# EAGLE design Adafruit SIM808 Shield (EAGLE 6.6.0)
COMPANY: ADAFRUIT INDUSTRIES; DRAWN: KTOWN; REV: C
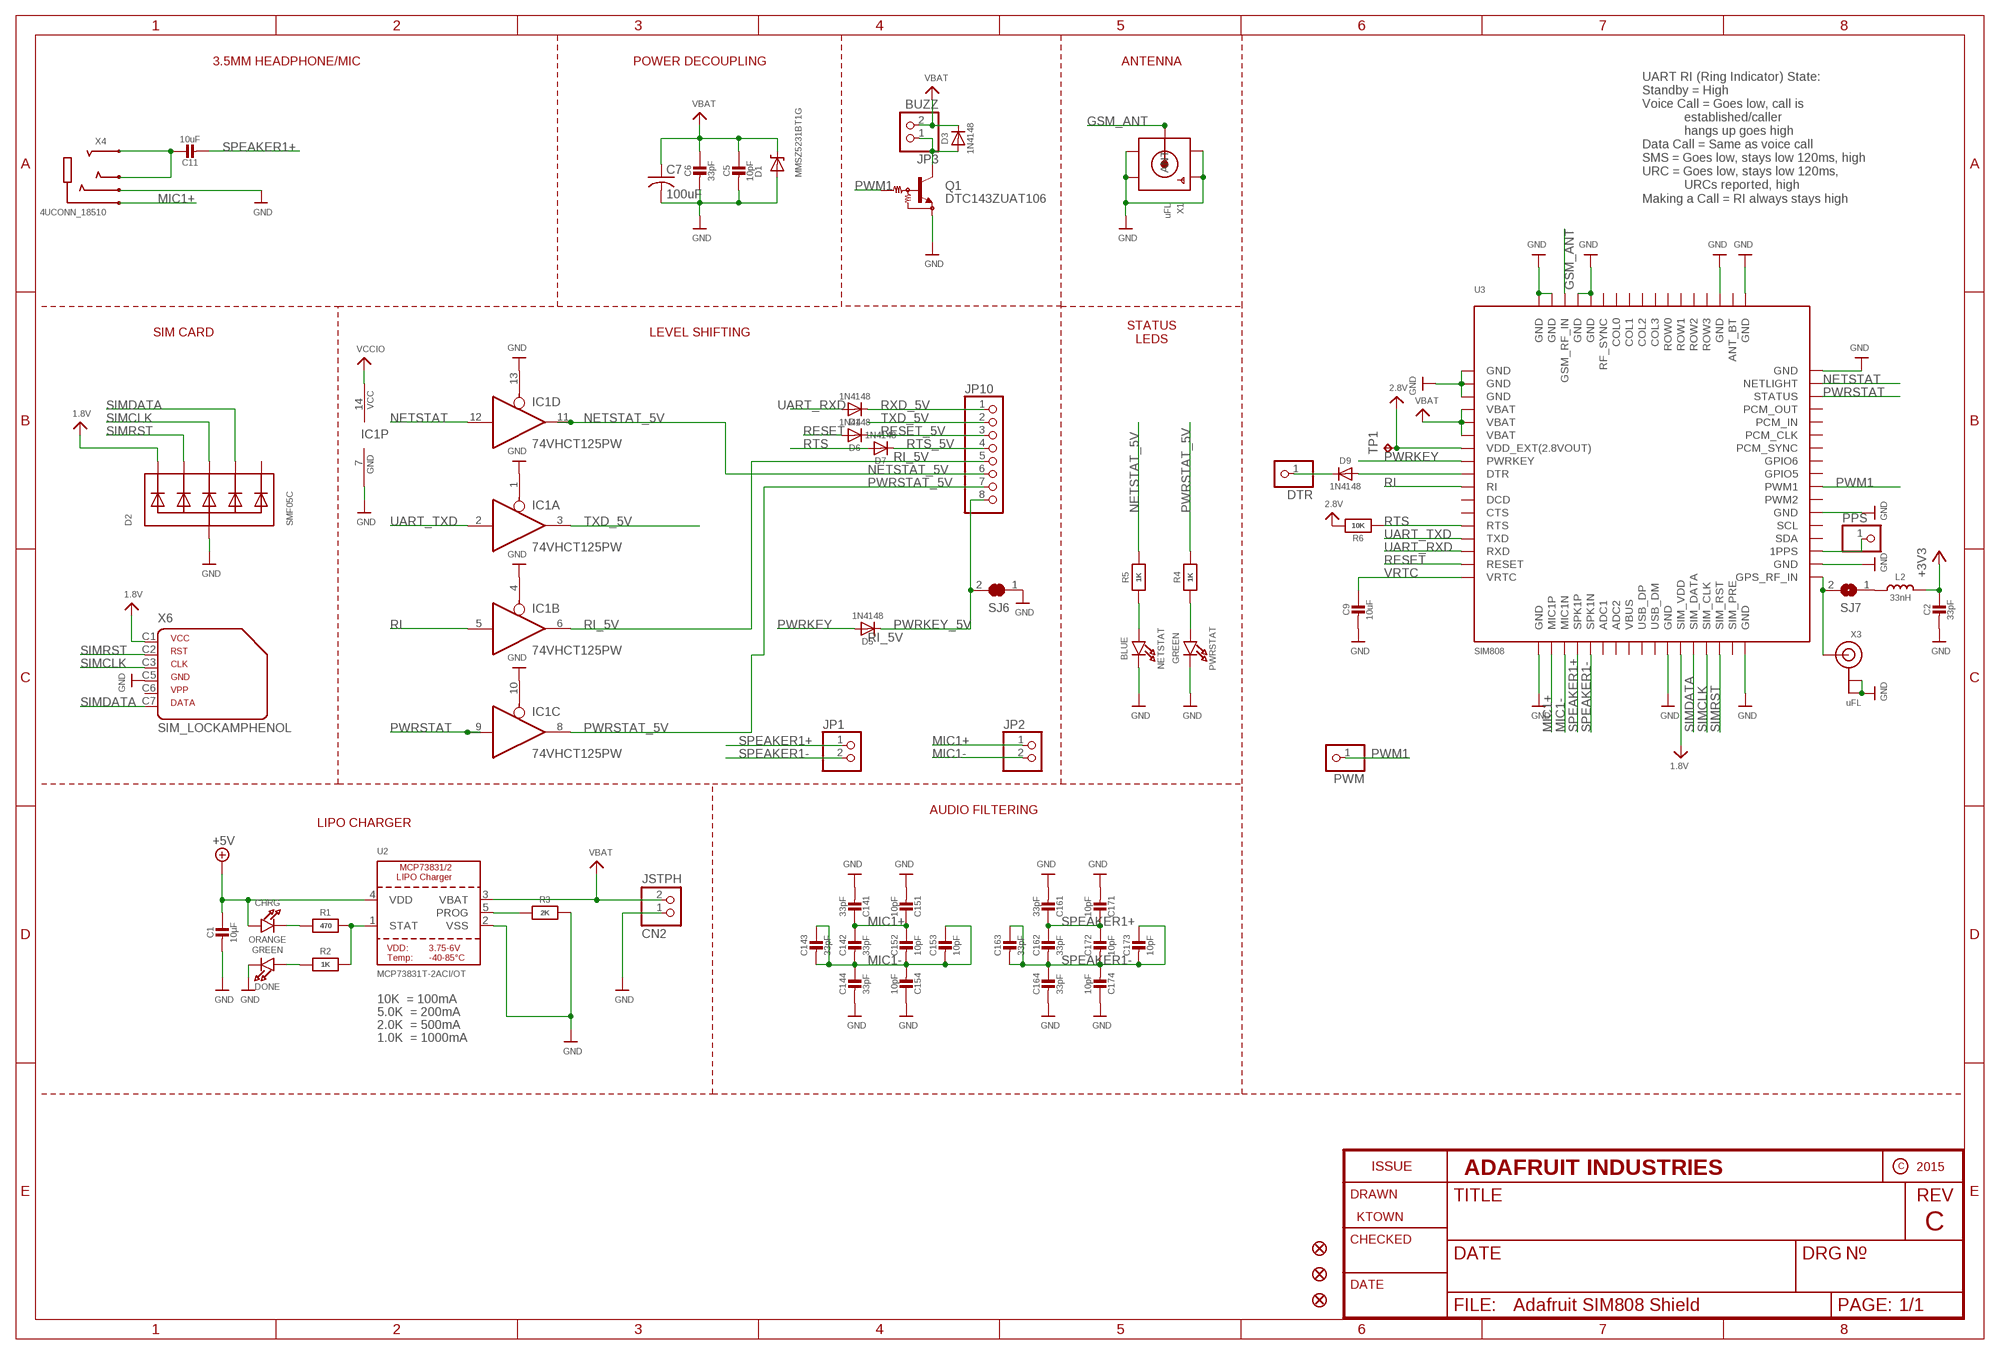
[diagram p0: schematic, sheet 1, part 1 of 2]
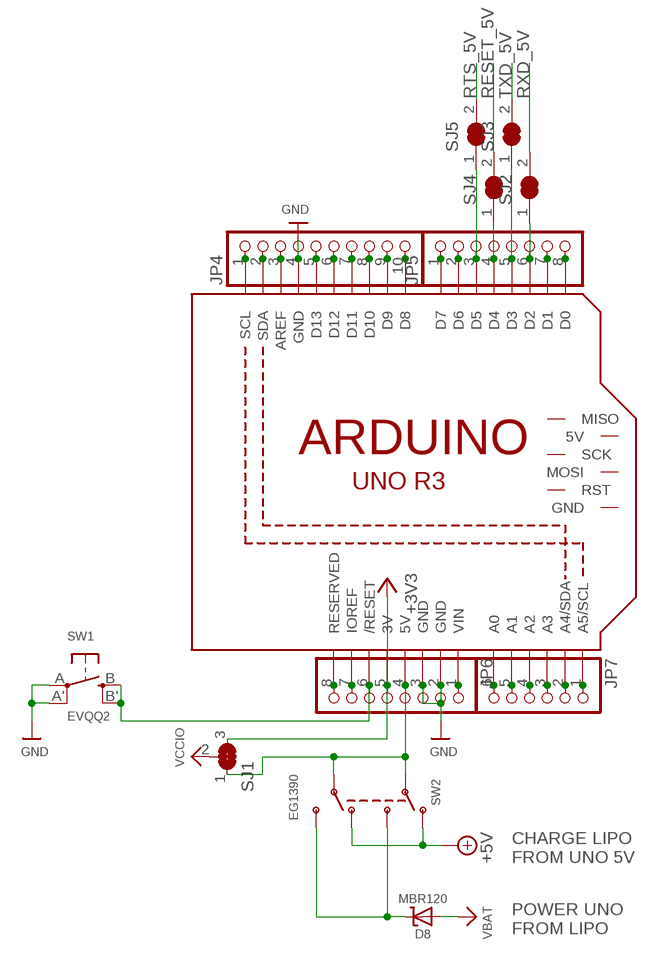
[diagram p1: schematic, sheet 1, part 2 of 2]

## Parts
C1  10µF  CAP_CERAMIC0805-NOOUTLINE  [0805-NO]
C2  33pF  CAP_CERAMIC0805-NOOUTLINE  [0805-NO]
C5  10pF  CAP_CERAMIC0805-NOOUTLINE  [0805-NO]
C6  33pF  CAP_CERAMIC0805-NOOUTLINE  [0805-NO]
C7  100uF  C-USC1210  [C1210]
C9  10uF  CAP_CERAMIC0805-NOOUTLINE  [0805-NO]
C11  10uF  CAP_CERAMIC0805-NOOUTLINE  [0805-NO]
C14  33pF  CAP_4PACK1206  [RESPACK_4X0603]
C15  10pF  CAP_4PACK1206  [RESPACK_4X0603]
C16  33pF  CAP_4PACK1206  [RESPACK_4X0603]
C17  10pF  CAP_4PACK1206  [RESPACK_4X0603]
CHRG  ORANGE  LED0805_NOOUTLINE  [CHIPLED_0805_NOOUTLINE]
CN2  JSTPH  JST_2PIN  [JSTPH2]
D1  MMSZ5231BT1G  DIODE-ZENERSOD123  [SOD-123]
D2  SMF05C  TVSARRAY_5LANE  [SOT363]
D3  1N4148  DIODESOD-323  [SOD-323]
D4  1N4148  DIODESOD-323  [SOD-323]
D5  1N4148  DIODESOD-323  [SOD-323]
D6  1N4148  DIODESOD-323  [SOD-323]
D7  1N4148  DIODESOD-323  [SOD-323]
D8  MBR120  DIODE-SCHOTTKYSOD-123  [SOD-123]
D9  1N4148  DIODESOD-323  [SOD-323]
DONE  GREEN  LED0805_NOOUTLINE  [CHIPLED_0805_NOOUTLINE]
DTR  PINHD-1X1CB  [1X01-CLEANBIG]
FID1  FIDUCIAL""  [FIDUCIAL_1MM]
FID2  FIDUCIAL""  [FIDUCIAL_1MM]
FID3  FIDUCIAL""  [FIDUCIAL_1MM]
IC1  74VHCT125PW  74ABT125PW  [TSSOP14]
JP1  HEADER-1X2ROUND  [1X02_ROUND]
JP2  HEADER-1X2ROUND  [1X02_ROUND]
JP3  BUZZ  HEADER-1X2ROUND  [1X02_ROUND]
JP4  HEADER-1X1070MIL  [1X10_ROUND70]
JP5  HEADER-1X876MIL  [1X08_ROUND_76]
JP6  HEADER-1X876MIL  [1X08_ROUND_76]
JP7  HEADER-1X676MIL  [1X06_ROUND_76]
JP10  HEADER-1X870MIL  [1X08_ROUND_70]
L2  33nH  INDUCTOR_0805MP  [_0805MP]
M1  ARDUINO_R3_ICSP_NODIM  [ARDUINOR3_ICSP_NODIM]
NETSTAT  BLUE  LED0805_NOOUTLINE  [CHIPLED_0805_NOOUTLINE]
PPS  PINHD-1X1CB  [1X01-CLEANBIG]
PWM  PINHD-1X1CB  [1X01-CLEANBIG]
PWRSTAT  GREEN  LED0805_NOOUTLINE  [CHIPLED_0805_NOOUTLINE]
Q1  DTC143ZUAT106  MUN2211T1-NPN_DRIVER-SC59-BEC  [SC59-BEC]
R1  470  RESISTOR0805_NOOUTLINE  [0805-NO]
R2  1K  RESISTOR0805_NOOUTLINE  [0805-NO]
R3  2K  RESISTOR0805_NOOUTLINE  [0805-NO]
R4  1K  RESISTOR0805_NOOUTLINE  [0805-NO]
R5  1K  RESISTOR0805_NOOUTLINE  [0805-NO]
R6  10K  RESISTOR0805_NOOUTLINE  [0805-NO]
SJ1  SOLDERJUMPER_2WAY  [SOLDERJUMPER_2WAY_OPEN_NOPASTE]
SJ2  SOLDERJUMPER_CLOSED  [SOLDERJUMPER_CLOSEDWIRE]
SJ3  SOLDERJUMPER_CLOSED  [SOLDERJUMPER_CLOSEDWIRE]
SJ4  SOLDERJUMPER_CLOSED  [SOLDERJUMPER_CLOSEDWIRE]
SJ5  SOLDERJUMPER_CLOSED  [SOLDERJUMPER_CLOSEDWIRE]
SJ6  SOLDERJUMPER_CLOSED  [SOLDERJUMPER_CLOSEDWIRE]
SJ7  SOLDERJUMPER  [SOLDERJUMPER_ARROW_NOPASTE]
SW1  EVQQ2  SWITCH_TACT_SMT  [EVQ-Q2]
SW2  EG1390  SWITCH_DPDTEG1390  [EG1390]
TP1  TPTP11R  [TP11R]
U2  MCP73831T-2ACI/OT  MCP73831/2  [SOT23-5]
U3  SIM808  GSM_SIM808_LITERAL  [SIM900_SMT]
X1  uFL  SMACONNECTOR_EDGE_UFL  [SMA_EDGELAUNCH_UFL]
X3  uFL  ANTENNA_U.FL  [U.FL]
X4  4UCONN_18510  AUDIO_3.5MMJACK_4POL  [4UCONN_18510]
X6  SIM_LOCKAMPHENOL  [C707_10M006_512_2]

## Nets
1.8V: D2.1(C1) U3.P$29(SIM_VDD) X6.C1
2.8V: R6.2 TP1.TP U3.P$7(VDD_EXT(2.8VOUT))
5V: JP6.4 M1.5V SJ1.1 SW2.P1 SW2.P2
+3V3: C2.1 JP6.5 L2.2 M1.3V SJ1.3
+5V: C1.1 CHRG.A SW2.O1 SW2.O2 U2.4(VDD)
A0: JP7.6 M1.A0
A1: JP7.5 M1.A1
A2: JP7.4 M1.A2
A3: JP7.3 M1.A3
A4: JP7.2 M1.A4(A4/SDA)
A5: JP7.1 M1.A5(A5/SCL)
AREF: JP4.3 M1.AREF
BUZZ-: D3.A JP3.1 Q1.C
D0: JP5.8 M1.D0
D1: JP5.7 M1.D1
D2: JP5.6 M1.D2 SJ2.1
D3: JP5.5 M1.D3 SJ3.1
D4: JP5.4 M1.D4 SJ4.1
D5: JP5.3 M1.D5 SJ5.1
D6: JP5.2 M1.D6
D7: JP5.1 M1.D7
D8: JP4.10 M1.D8
D9: JP4.9 M1.D9
D10: JP4.8 M1.D10
D11: JP4.7 M1.D11
D12: JP4.6 M1.D12
D13: JP4.5 M1.D13
DTR_5V: D9.C DTR.1
GND: C1.2 C2.2 C5.2 C6.2 C7.2 C9.2 C14.5 C14.8 C15.4 C15.8 C16.5 C16.8 C17.4 C17.8 CN2.1 D1.A D2.2(A) DONE.C IC1.1(A:OE) IC1.4(B:OE) IC1.7(P:GND) IC1.10(C:OE) IC1.13(D:OE) JP4.4 JP6.2 JP6.3 M1.GND M1.GND@1(GND) M1.GND@3(GND) NETSTAT.C PWRSTAT.C Q1.E R3.2 SJ6.1 SW1.A'(P1) SW1.A(P) U2.2(VSS) U3.P$1(GND) U3.P$2(GND) U3.P$3(GND) U3.P$18(GND) U3.P$28(GND) U3.P$34(GND) U3.P$36(GND) U3.P$40(GND) U3.P$51(GND) U3.P$52(GND) U3.P$54(GND) U3.P$64(GND) U3.P$65(GND) U3.P$67(GND) U3.P$68(GND) X1.GND@1(GND1) X1.GND@2(GND2) X1.GND@3(GND3) X1.GND@4(GND4) X3.1(GND) X3.2(GND) X4.4-INNER_SLEEVE(RING1) X6.C5
GPS_PPS: PPS.1 U3.P$37(1PPS)
GSM_ANT: U3.P$66(GSM_RF_IN) X1.P(ANT)
HP+: C11.1 X4.2-TIP(RING3) X4.3-OUTER_SLEEVE(RING2)
IOREF: JP6.7 M1.IOREF
MIC1+: C14.1 C14.2 C15.1 C15.2 JP2.1 U3.P$19(MIC1P) X4.1-GND(TIP)
MIC1-: C14.3 C14.4 C14.6 C14.7 C15.3 C15.5 C15.6 C15.7 JP2.2 U3.P$20(MIC1N)
N$1: CHRG.C R1.1
N$2: R1.2 R2.2 U2.1(STAT)
N$3: SJ7.2 U3.P$35(GPS_RF_IN) X3.3(SIGNAL)
N$4: PWRSTAT.A R4.1
N$5: R3.1 U2.5(PROG)
N$6: DONE.A R2.1
N$9: NETSTAT.A R5.1
N$10: D8.C SW2.S1 SW2.S2
N$31: L2.1 SJ7.1
N$42: D9.A U3.P$9(DTR)
NC: JP6.8 M1.RESERVED
NETSTAT: IC1.12(D:I) U3.P$50(NETLIGHT)
NETSTAT_5V: IC1.11(D:O) JP10.6 R5.2
PWM1: PWM.1 Q1.B U3.P$42(PWM1)
PWRKEY: D5.A U3.P$8(PWRKEY)
PWRKEY_5V: D5.C JP10.8 SJ6.2
PWRSTAT: IC1.9(C:I) U3.P$49(STATUS)
PWRSTAT_5V: IC1.8(C:O) JP10.7 R4.2
RESET: D6.A U3.P$16(RESET)
RESET_5V: D6.C JP10.3 SJ4.2
RI: IC1.5(B:I) U3.P$10(RI)
RI_5V: IC1.6(B:O) JP10.5
RST: JP6.6 M1.RESET(/RESET) SW1.B'(S1) SW1.B(S)
RTS: D7.A R6.1 U3.P$13(RTS)
RTS_5V: D7.C JP10.4 SJ5.2
RXD_5V: D4.C JP10.1 SJ2.2
SCL: JP4.1 M1.SCL
SDA: JP4.2 M1.SDA
SIMCLK: D2.4(C3) U3.P$31(SIM_CLK) X6.C3
SIMDATA: D2.5(C4) U3.P$30(SIM_DATA) X6.C7
SIMRST: D2.3(C2) U3.P$32(SIM_RST) X6.C2
SPEAKER1+: C11.2 C16.1 C16.2 C17.1 C17.2 JP1.1 U3.P$21(SPK1P)
SPEAKER1-: C16.3 C16.4 C16.6 C16.7 C17.3 C17.5 C17.6 C17.7 JP1.2 U3.P$22(SPK1N)
TXD_5V: IC1.3(A:O) JP10.2 SJ3.2
UART_RXD: D4.A U3.P$15(RXD)
UART_TXD: IC1.2(A:I) U3.P$14(TXD)
VBAT: C5.1 C6.1 C7.1 CN2.2 D1.C D3.C D8.A JP3.2 U2.3(VBAT) U3.P$4(VBAT) U3.P$5(VBAT) U3.P$6(VBAT)
VCCIO: IC1.14(P:VCC) SJ1.2
VIN: JP6.1 M1.VIN
VRTC: C9.1 U3.P$17(VRTC)
Unconnected: D2.6(C5) M1.5V_ICSP(5V) M1.GND@2(GND) M1.MISO M1.MOSI M1.RESET_ICSP(RST) M1.SCK U3.P$11(DCD) U3.P$12(CTS) U3.P$23(ADC1) U3.P$24(ADC2) U3.P$26(USB_DP) U3.P$27(USB_DM) U3.P$33(SIM_PRE) U3.P$38(SDA) U3.P$39(SCL) U3.P$41(PWM2) U3.P$43(GPIO5) U3.P$44(GPIO6) U3.P$45(PCM_SYNC) U3.P$46(PCM_CLK) U3.P$47(PCM_IN) U3.P$48(PCM_OUT) U3.P$53(ANT_BT) U3.P$55(ROW3) U3.P$56(ROW2) U3.P$57(ROW1) U3.P$58(ROW0) U3.P$59(COL3) U3.P$60(COL2) U3.P$61(COL1) U3.P$62(COL0) U3.P$63(RF_SYNC) X6.C6

## Notes on the sheet
- 3.5MM HEADPHONE/MIC | POWER DECOUPLING | ANTENNA
- UART RI (Ring Indicator) State:
  Standby = High
  Voice Call = Goes low, call is 
              established/caller 
              hangs up goes high
  Data Call = Same as voice call
  SMS = Goes low, stays low 120ms, high
  URC = Goes low, stays low 120ms,
              URCs reported, high
  Making a Call = RI always stays high
- SIM CARD | LEVEL SHIFTING
- STATUS
  LEDS
- AUDIO FILTERING
- LIPO CHARGER
- CHARGE LIPO
  FROM UNO 5V
- POWER UNO
  FROM LIPO
- 10K  = 100mA
- 5.0K  = 200mA
- 2.0K  = 500mA
- 1.0K  = 1000mA

## Power pins joined to a net without a drawn wire
VBUS: U3.P$25(VBUS)

## Library data of the parts
C1 C2 C5 C6 C9 C11 = microbuilder:CAP_CERAMIC: Ceramic Capacitors For new designs, use the packages preceded by an '_' character since they are more reliable: The following footprints should be used on most boards: _0402 - Standard footprint for regular board layouts _0603 - Standard footprint for regular board layouts _0805 - Standard footprint for regular board layouts _1206 - Standard footprint for regular board layouts For extremely tight-pitch boards where space is at a premium, the following 'micro-pitch' footprints can be used (smaller pads, no silkscreen outline, etc.): _0402MP - Micro-pitch footprint for very dense/compact boards _0603MP - Micro-pitch footprint for very dense/compact boards _0805MP - Micro-pitch footprint for very dense/compact boards _1206MP - Micro-pitch footprint for very dense/compact boards
C7 = rcl:C-US: CAPACITOR, American symbol
C14-C17 = microbuilder:CAP_4PACK
CHRG DONE NETSTAT PWRSTAT = microbuilder:LED: LED 0603 - 0603 Surface Mount Package 2mA: Green LED - Low Power (3.9mcd, 2ma, 1.7Vf) - Digikey: 475-2709-2-ND Orange LED - Low Power (9.8mcd, 2ma, 1.8Vf) - Digikey: 475-1194-2-ND Red LED - Low Power (5mcd, 2ma, 1.8Vf) - Digikey: 475-1195-2-ND Yellow LED - Low Power (7mcd, 2ma, 1.8Vf) - Digikey: 475-1196-2-ND 5mA: Blue LED - Low Power (17mcd, 5ma, 2.9Vf) - Digikey: LNJ937W8CRACT-ND 0805 - 0805 Surface Mount Package 2mA: Red LED (8.8mcd, 2mA, 1.8Vf, Clear) - Low Power [Digikey: 475-2510-1-ND] Green LED (5mcd, 2mA, 1.8Vf, Clear) - Low Power [Digikey: 475-2730-1-ND] Yellow LED (11.3mcd, 2mA, 1.8Vf, Clear) - Low Power [Digikey: 475-2555-1-ND] 20mA: Red LED (104mcd, 20mA, Diffused) - LS R976 [Digikey: 475-1278-6-ND] Red LED (12mcd, 20mA, 2.0Vf, Clear) - APT2012EC [Digikey: 754-1128-1-ND] Green LED (15mcd, 20mA, 2.2Vf, Clear) - APT2012GC [Digikey: 754-1131-1-ND] Orange LED (160mcd, 20mA, 2.1Vf, Clear) - APT2012SECK [Digikey: 754-1130-1-ND] 1206 - 1206 Surface Mount Package Green LED (26mcd, 20mA, Diffused) - LG N971 [Digikey: 475-1407-6-ND] Red LED (15mcd, 20mA, Diffused) - LH N974 [Digikey: 475-1416-6-ND] Cree - Cree High-Power Surface Mount LEDs XPEBWT-L1-0000-00D50 - White 111lm 350mA 2.9Vf 6200K 110° XTEAWT-00-0000-00000LEE3 - White 114lm 350mA 2.85Vf 5000K 115° Everlight - Everlight 45-21 Series Surface Mount LEDs 45-21/QK2C-B2832AC2CB2/2T - Warm White 2000mcd 20mA 3.25Vf 3050K 120° 45-21/LK2C-B38452C4CB2/2T - Nuetral White 2000mcd 20mA 3.25Vf 4150K 120° 45-21/LK2C-B50634C6CB2/2T - Cold White 2200mcd 20mA 3.25Vf 5650K 120° PLCC2 Reverse Mount LS T77K-J1L2-1-0-2-R18-Z - Red 11.25mcd 2mA 1.8Vf 630nm 120° LO T77K-L1M2-24-Z - Orange 19.6mcd 2mA 1.8Vf 606nm 120° LY T77K-K2M1-26-Z - Yellow 15.7mcd 2mA 1.8Vf 587nm 120°
CN2 = microbuilder:JST_2PIN: JST 2-Pin Right-Angle Connector PH-Series - 4UConnector: 17311 SH-Series - 4UConnector: 07278
D1 = microbuilder:DIODE-ZENER: Zener Diode SMA: 30V 1W Zener Diode, 1.2Vf - Digikey: SMAZ30-FDICT-ND
D2 = microbuilder:TVSARRAY_5LANE: Voltage Transient Suppressor Array SOT363 SMF05C - 100W 5V: Digikey - SMF05CT1GOSCT-ND
D3-D7 D9 = microbuilder:DIODE: Diode SMA Model Volts Amps Type Vf Ir Digikey # Notes SSA34-E3 40V 3A Schottky 480mV @ 3A 200uA @ 40V SSA34-E3/61TGITR-ND CDBA120-G 20V 1A Schottky 500mV @ 1A 500uA @ 20V 641-1014-6-ND REEL MBRA210 10V 2A Schottky 350mV @ 2A 700uA @ 10V MBRA210LT3 SOD-123 Model Volts Amps Type Vf Ir Order # Notes BAT54T1G 30V 200mA Schottky 800mV @ 200mA 2uA @ 25V BAT54T1GOSTR-ND B0530W 30V 500mA Schottky 430mV @ 500mA 130uA @ 30V B0530W-FDICT-ND REEL MBR120 20V 1A Schottky 340mV @ 1A MBR120VLSFT1GOSCT-ND SOD-323 Model Volts Amps Type Vf Ir Order # Notes PMEG2005EJ 20V 500mA Schottky 355mV @ 500mA 568-4110-1-ND ZLLS410 10V 570mA Schottky 380mV @ 570mA ZLLS410CT-ND 1N4148WS 75V 150mA Silicon/Simple 1V 1N4148WSFSCT-ND REEL SOD-523 Model Volts Amps Type Vf Ir Order # Notes BAT54XV2 30V 200mA Schottky 0.8V @ 100mA BAT54XV2CT-ND TB751S 30V 30mA Schottky RB751S-40TE61CT-ND SOT23-R/W (R = Solder Paste/Reflow Ovens, W = Hand-Soldering) Model Volts Amps Type Vf Ir Order # Notes BAT54FILM 40V 300mA Schottky 497-7162-1-ND POWERDI-5 Model Volts Amps Type Vf Ir Order # Notes PDS560 60V 5A Schottky 670mV @ 5A 150uA @ 60V PDS560DICT-ND
D8 = microbuilder:DIODE-SCHOTTKY
DTR PPS PWM = adafruit:PINHD-1X1: Pin header 1x1 for 0.1" spacing With round pins
FID1-FID3 = microbuilder:FIDUCIAL: Fiducial Alignment Points Various fiducial points for machine vision alignment.; BOM: EXCLUDE
IC1 = 74xx-us:74*125: Quad bus BUFFER, 3-state
JP1-JP3 = microbuilder:HEADER-1X2: PIN HEADER
JP4 = microbuilder:HEADER-1X10: PIN HEADER
JP5 JP6 JP10 = microbuilder:HEADER-1X8: PIN HEADER
JP7 = microbuilder:HEADER-1X6: PIN HEADER
L2 = microbuilder:INDUCTOR: Inductors 0603: 10nH Ceramic Inductor - microwire antenna/RF (Digikey: 712-1434-2-ND) 0805: 560nH Ceramic Inductor - RF (Digikey: 553-1047-1-ND) 270nH Ceramic Inductor - Q = 40@250MHz, +-5%, 1 Ohm DC Resistance (Digikey: 535-10506-2-ND) 1007 (2518 Metric) SMT: 10µH 10% 250mOhm 820mA 1007 Inductor (Digikey: 587-2189-1-ND) 22µH 10% 500mOhm 580mA 1007 Inductor (Digikey: 587-2190-1-ND) 47µH 10% 950mOhm 420mA 1007 Inductor (Digikey: 587-2191-1-ND) 47µH 5% 100mOhm 1A 1008 Inductor (Digikey: 732-1816-1-ND) 5.0x5.0mm (Taiyo Yuden NR5040 Series) 6.8µH 20% 2.3A 64mOhm Inductor (Digikey: 587-2374-2-ND) 5.0x5.0mm (TDK VLC5045 Series) 4.7µH 20% 3.3A 34mOhm Inductor (Digikey: 445-6526-1-ND) 6.8µH 20% 2.7A 46mOhm Inductor (Digikey: 445-6527-1-ND) 6.0x6.0mm (TDK VLC6045 Series) 4.7µH 20% 3.8A 27mOhm Inductor (Digikey: 445-6538-2-ND) 6.8µH 20% 3A 41mOhm Inductor (Digikey: 445-6540-1-ND) 6.2µH 30% 2.2A 45mOhm Inductor (Digikey: SRR5028-6R2YCT-ND) - Not TDK VLC6045 but footprint should match 6.0x6.0mm (TDK SLF6045 Series) 6.8uH 30% 2A 33mOhm Inductor (Digikey: 445-4572-1-ND, Mouser: 810-SLF645T6R8N2R0PF) 6.0x6.0mm (Sumida CDRH5D28 Series) 6.2uH 30% 1.8A 45mOhm Inductor (Digikey: 308-1542-1-ND) Taiyo Yuden NR3015T2R2M - 2.2uH 20% 1.5A (Digikey: 587-1648-2-ND, Mouser: 963-NR3015T2R2M) - Used with TI TPS62172 CoilCraft RFID Transponder Coil - MA5532-AE (For use with AS3935 Lightning Sensor) Vishay IHLP 1.0uH Molded Inductor - 24mOhm DCR, 5A, +/-20%, -55°C-125°C (Digikey: 541-1319-1-ND)
M1 = adafruit:ARDUINO_R3_ICSP
Q1 = transistor:*-NPN_DRIVER-: NPN Bias Resistor Transistor
R1-R6 = microbuilder:RESISTOR: Resistors For new designs, use the packages preceded by an '_' character since they are more reliable: The following footprints should be used on most boards: _0402 - Standard footprint for regular board layouts _0603 - Standard footprint for regular board layouts _0805 - Standard footprint for regular board layouts _1206 - Standard footprint for regular board layouts For extremely tight-pitch boards where space is at a premium, the following 'micro-pitch' footprints can be used (smaller pads, no silkscreen outline, etc.): _0402MP - Micro-pitch footprint for very dense/compact boards _0603MP - Micro-pitch footprint for very dense/compact boards _0805MP - Micro-pitch footprint for very dense/compact boards _1206MP - Micro-pitch footprint for very dense/compact boards
SJ1 = microbuilder:SOLDERJUMPER_2WAY: 2-Way Solder Jumper
SJ2-SJ6 = microbuilder:SOLDERJUMPER_CLOSED: Solder Jumper - Closed These solder jumpers are closed by default CLOSEDWIRE - 10 mil trace between pads that can be cut and resoldered later CLOSEDPERM - 63 mil trace between pads for a permanent connection (used to 'bridge' two signals, a shameless hack for Eagle). Can double as a test point as well (no cream layer)
SJ7 = microbuilder:SOLDERJUMPER: SMD Solder JUMPER Solder the two pads together to create a connection, or remove the solder to break it. REFLOW - Use this footprint for solder paste and reflow ovens. WAVE - Use this footprint for hand-soldering (larger pads). CLOSED - Has a trace between the two pads to ensure it is closed by default. The trace needs to be cut to disable the jumper, and can be closed again by creating a solder bridge between the two pads.; BOM: EXCLUDE
SW1 = microbuilder:SWITCH_TACT_SMT: SMT Tact Switches 6x6mm - Digikey: P12940SCT-ND KMR2 (4.6x2.8mm) - Digikey: 401-1426-1-ND EVQ-PQHB55 - Light Touch, 160GF (4.5x4.5mm) - Digikey: P8090SCT-ND KMT0 - KMT021 NGJ LHS (etc.) IP68/Waterproof - Digikey: CKN10289CT-ND
SW2 = microbuilder:SWITCH_DPDT: Switch - DPDT A DPDT Switch acts like an SPDT switch, but has a pair of switches instead of just one. Vertical - 0.3A @ 6V SMT - Digikey: JS202011SCQN
TP1 = testpad:TP: Test pad
U2 = microbuilder:MCP73831/2: MCP73831/2 LIPO Charger VDD: 3.75 - 6V Temp -40 - 85°C Programmable Charge Rate: 15-500mA NOTE: STAT is a tri-state logic output on the MCP73831 and an open-drain output on the MCP73832. SOT23-5 with 4.2V output and tri-state logic on STAT = MCP73831T-2ACI/OT
U3 = microbuilder:GSM_SIM808_LITERAL: SIM808 GSM Module
X1 = microbuilder:SMACONNECTOR: SMA Connector 90° DIP SMA Connector, 50 Ohm (4UConnector: 07259)
X3 = microbuilder:ANTENNA_U.FL: U.FL Antenna Connector
X4 = microbuilder:AUDIO_3.5MMJACK_4POL: Footprint courtesy Morten Hjerde (Riftlabs.com) These are normally connected as follows (4-pin 3.5mm 'TRRS'), from left-to right on the schematic symbol above: Tip: Left Audio Outermost Ring: Right Audio Innermost Ring: Common/GND Shell: Mic+
X6 = microbuilder:SIM_LOCK: C707A SIMLOCK® 2.5 mm with wide solder tails Source: Data sheet <http://www.amphenol.info/downloads/C707_10M006_512_2.pdf>; OC_FARNELL: unknown; OC_NEWARK: unknown

## Board
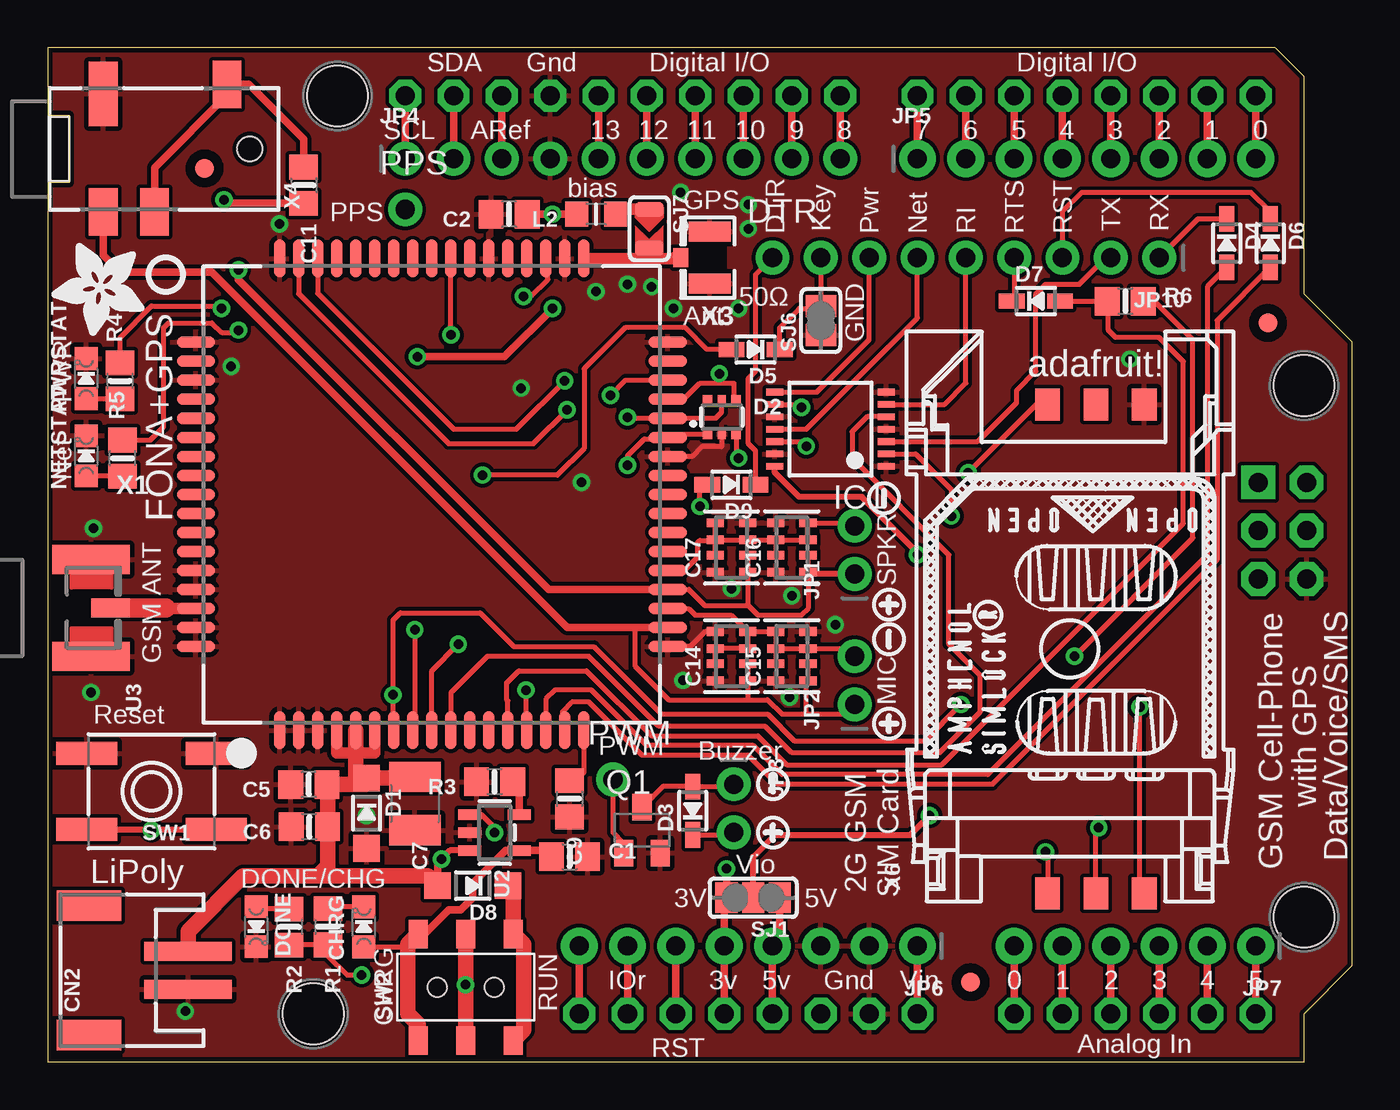
[diagram p2: board, top side]
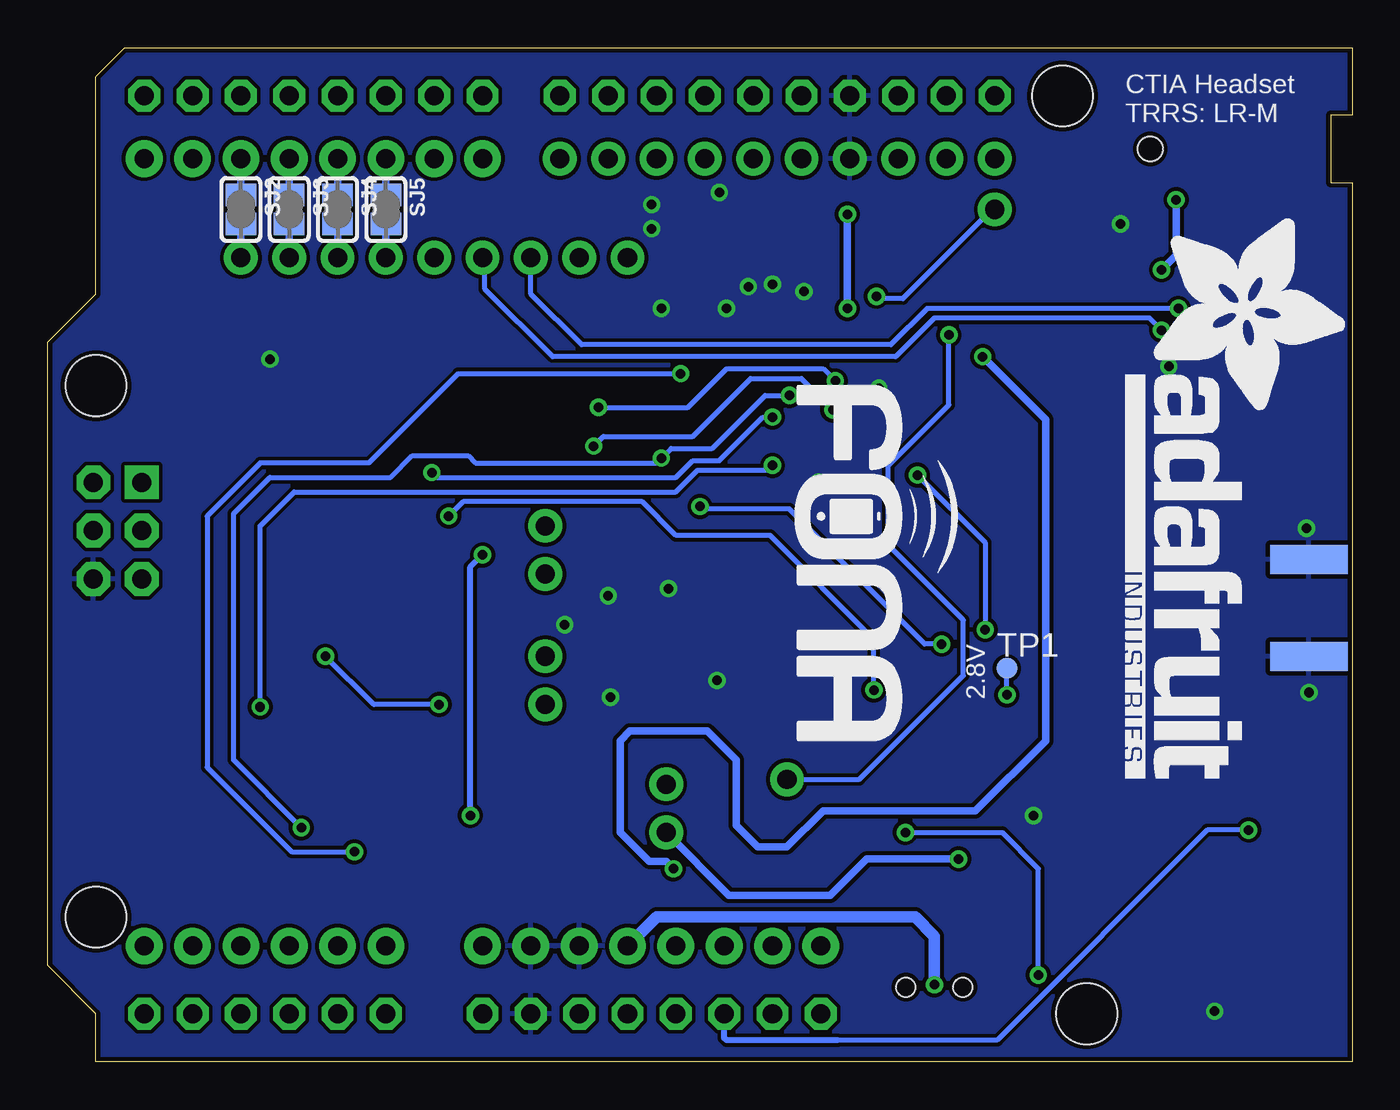
[diagram p3: board, bottom side, seen from below]

Size 68.58 x 53.34 mm. Coordinates in mm from the lower left corner, seen from the top.
Outline: 0,0 66.04,0 66.04,2.54 68.58,5.08 68.58,37.85 66.04,40.39 66.04,51.82 64.52,53.34 0,53.34 0,49.78 1.14,49.78 1.14,46.23 0,46.23 0,0
Copper layers (1*16): Top 0.035mm / dielectric 1.5mm / Bottom 0.035mm
Design rules "adafruit *": minimum track width 8mil, minimum drill 15.5mil, track to track 8mil, track to pad 8mil, pad to pad 8mil, via to via 8mil, smd to smd 8mil, copper to edge 10mil, drill to drill 8mil, minimum pad ring 10mil, minimum via ring 8mil, stop-mask expansion 2mil, vias tented up to drill 20mil, thermal gap 10mil
Holes 3.2 mm at 15.24,50.8 66.04,35.56 66.04,7.62 13.97,2.54

### Footprints (pad centres in the part's own frame; a part is rotated, then mirrored left to right if it is on the bottom)
0805-NO = smd 1.3 x 1.5: 1 -0.95,0; 2 0.95,0
C1210 = smd 1.6 x 2.7: 1 -1.4,0; 2 1.4,0
RESPACK_4X0603 = smd 0.45 x 0.9: 1 -1.3,-0.85; 2 -0.4,-0.85; 3 0.4,-0.85; 4 1.3,-0.85; 5 1.3,0.85; 6 0.4,0.85; 7 -0.4,0.85; 8 -1.3,0.85
CHIPLED_0805_NOOUTLINE = smd 1.2 x 1.2: A 0,-1.05; C 0,1.05
JSTPH2 = smd 1 x 4.6: 1 -1,-3.7; 2 1,-3.7 | smd 1.6 x 3.4: NC1 -3.4,1.5; NC2 3.4,1.5
SOD-123 = smd 1.4 x 1.4: A 1.85,0; C -1.85,0
SOT363 = smd 0.5 x 0.5: 1 -0.75,-0.9; 3 0.75,-0.9; 4 0.75,0.9; 6 -0.75,0.9 | smd 0.4 x 0.5: 2 0,-0.9; 5 0,0.9
SOD-323 = smd 1.35 x 0.8: A 1.27,0; C -1.27,0
1X01-CLEANBIG = drill 1.016 pad 1.778: 1 0,0
FIDUCIAL_1MM = smd 1 x 1: 1 0,0
TSSOP14 = smd 0.35 x 0.9: 1 -1.95,-2.925; 2 -1.3,-2.925; 3 -0.65,-2.925; 4 0,-2.925; 5 0.65,-2.925; 6 1.3,-2.925; 7 1.95,-2.925; 8 1.95,2.925; 9 1.3,2.925; 10 0.65,2.925; 11 0,2.925; 12 -0.65,2.925; 13 -1.3,2.925; 14 -1.95,2.925
1X02_ROUND = drill 1 pad 1.778: 1 -1.27,0; 2 1.27,0
1X10_ROUND70 = drill 1 pad 1.778: 1 -11.43,0; 2 -8.89,0; 3 -6.35,0; 4 -3.81,0; 5 -1.27,0; 6 1.27,0; 7 3.81,0; 8 6.35,0; 9 8.89,0; 10 11.43,0
1X08_ROUND_76 = drill 1 pad 1.93: 1 -8.89,0; 2 -6.35,0; 3 -3.81,0; 4 -1.27,0; 5 1.27,0; 6 3.81,0; 7 6.35,0; 8 8.89,0
1X06_ROUND_76 = drill 1 pad 1.93: 1 -6.35,0; 2 -3.81,0; 3 -1.27,0; 4 1.27,0; 5 3.81,0; 6 6.35,0
1X08_ROUND_70 = drill 1 pad 1.778: 1 -8.89,0; 2 -6.35,0; 3 -3.81,0; 4 -1.27,0; 5 1.27,0; 6 3.81,0; 7 6.35,0; 8 8.89,0
_0805MP = smd 1.2 x 1.3: 1 -1.016,0; 2 1.016,0
ARDUINOR3_ICSP_NODIM = drill 1 pad 1.676 octagon: 3V 35.56,2.54; 5V 38.1,2.54; A0 50.8,2.54; A1 53.34,2.54; A2 55.88,2.54; A3 58.42,2.54; A4 60.96,2.54; A5 63.5,2.54; AREF 23.876,50.8; D0 63.5,50.8; D1 60.96,50.8; D2 58.42,50.8; D3 55.88,50.8; D4 53.34,50.8; D5 50.8,50.8; D6 48.26,50.8; D7 45.72,50.8; D8 41.656,50.8; D9 39.116,50.8; D10 36.576,50.8; D11 34.036,50.8; D12 31.496,50.8; D13 28.956,50.8; GND 26.416,50.8; GND@1 43.18,2.54; GND@2 40.64,2.54; IOREF 30.48,2.54; RESERVED 27.94,2.54; RESET 33.02,2.54; SCL 18.796,50.8; SDA 21.336,50.8; VIN 45.72,2.54 | drill 1 pad 1.778 octagon: 5V_ICSP 66.167,30.48; GND@3 66.167,25.4; MOSI 66.167,27.94; RESET_ICSP 63.627,25.4; SCK 63.627,27.94 | drill 1 pad 1.778 square: MISO 63.627,30.48
SC59-BEC = smd 1 x 1.4: B -0.95,-1.2; C 0,1.2; E 0.95,-1.2
SOLDERJUMPER_2WAY_OPEN_NOPASTE = smd 1.168 x 1.6: 1 -1.397,0; 2 0,0; 3 1.397,0
SOLDERJUMPER_CLOSEDWIRE = smd 1.168 x 1.6: 1 -0.762,0; 2 0.762,0 | smd 0.635 x 0.203: WIRE 0,0
SOLDERJUMPER_ARROW_NOPASTE = smd 0.762 x 1.524: 1 -1.016,0; 2 1.016,0
EVQ-Q2 = smd 3.2 x 1.2: A -3.4,-2; A' 3.4,-2; B -3.4,2; B' 3.4,2
EG1390 = smd 1 x 1.5: O1 -2.5,2.8; O2 -2.5,-2.8; P1 0,2.8; P2 0,-2.8; S1 2.5,2.8; S2 2.5,-2.8 | hole 1: 1.5,0; -1.5,0
TP11R = smd 1.1 x 1.1: TP 0,0
SOT23-5 = smd 0.55 x 1.2: 1 -0.95,-1.3; 2 0,-1.3; 3 0.95,-1.3; 4 0.95,1.3; 5 -0.95,1.3
SIM900_SMT = smd 2 x 0.6: P$1 -12.4,8; P$2 -12.4,7; P$3 -12.4,6; P$4 -12.4,5; P$5 -12.4,4; P$6 -12.4,3; P$7 -12.4,2; P$8 -12.4,1; P$9 -12.4,0; P$10 -12.4,-1; P$11 -12.4,-2; P$12 -12.4,-3; P$13 -12.4,-4; P$14 -12.4,-5; P$15 -12.4,-6; P$16 -12.4,-7; P$17 -12.4,-8; P$35 12.4,-8; P$36 12.4,-7; P$37 12.4,-6; P$38 12.4,-5; P$39 12.4,-4; P$40 12.4,-3; P$41 12.4,-2; P$42 12.4,-1; P$43 12.4,0; P$44 12.4,1; P$45 12.4,2; P$46 12.4,3; P$47 12.4,4; P$48 12.4,5; P$49 12.4,6; P$50 12.4,7; P$51 12.4,8 | smd 0.6 x 2: P$18 -8,-12.4; P$19 -7,-12.4; P$20 -6,-12.4; P$21 -5,-12.4; P$22 -4,-12.4; P$23 -3,-12.4; P$24 -2,-12.4; P$25 -1,-12.4; P$26 0,-12.4; P$27 1,-12.4; P$28 2,-12.4; P$29 3,-12.4; P$30 4,-12.4; P$31 5,-12.4; P$32 6,-12.4; P$33 7,-12.4; P$34 8,-12.4; P$52 8,12.4; P$53 7,12.4; P$54 6,12.4; P$55 5,12.4; P$56 4,12.4; P$57 3,12.4; P$58 2,12.4; P$59 1,12.4; P$60 0,12.4; P$61 -1,12.4; P$62 -2,12.4; P$63 -3,12.4; P$64 -4,12.4; P$65 -5,12.4; P$66 -6,12.4; P$67 -7,12.4; P$68 -8,12.4
SMA_EDGELAUNCH_UFL = smd 4.064 x 1.524: GND@1 2.032,-2.54; GND@2 2.032,2.54 | smd 4.064 x 1.524 bottom: GND@3 2.032,2.54; GND@4 2.032,-2.54 | smd 2.032 x 1.016: P 3.048,0
U.FL = smd 2.2 x 1.05: 1 0,1.375; 2 0,-1.375 | smd 0.8 x 1: 3 1.525,0
4UCONN_18510 = smd 1.5 x 2.5: 1-GND 2.8,-3.3; 2-TIP 9.3,3.4; 3-OUTER_SLEEVE 5.5,-3.3 | smd 1.5 x 3.4: 4-INNER_SLEEVE 2.8,2.9 | hole 1.3: 10.5,0
C707_10M006_512_2 = smd 1.7 x 1.3: C1 -12.85,-3.915; C2 -12.85,-1.375; C3 -12.85,1.165; C5 12.85,-3.915; C6 12.85,-1.375; C7 12.85,1.165

### Placement (x,y rotation side)
C1  27.43,10.79 0 top
C2  24.26,44.58 180 top
C5  13.73,14.59 180 top
C6  13.76,12.37 180 top
C7  19.3,13.59 270 top
C9  27.43,13.84 270 top
C11  13.46,46.1 270 top
C14  35.94,21.34 90 top
C15  39.12,21.34 90 top
C16  39.12,27.05 90 top
C17  35.94,27.05 90 top
CHRG  16.63,7.11 0 top
CN2  3.68,4.83 90 top
D1  16.76,13.08 270 top
D2  35.43,33.91 0 top
D3  33.91,13.21 90 top
D4  61.98,43.05 270 top
D5  37.21,37.47 180 top
D6  64.26,43.05 270 top
D7  51.94,40.01 0 top
D8  22.35,9.27 180 top
D9  35.94,30.35 180 top
DONE  10.97,7.12 180 top
DTR  38.1,42.29 0 top
FID1  48.51,4.19 0 top
FID2  64.14,38.86 0 top
FID3  8.26,46.99 0 top
IC1  41.15,33.27 90 top
JP1  42.42,26.92 90 top
JP2  42.42,20.07 90 top
JP3  36.07,13.34 270 top
JP4  30.23,47.5 0 top
JP5  54.61,47.5 0 top
JP6  36.83,6.1 180 top
JP7  57.15,6.1 180 top
JP10  49.53,42.29 180 top
L2  28.83,44.58 180 top
M1  0,0 0 top
NETSTAT  2.03,31.88 0 top
PPS  18.8,44.83 0 top
PWM  29.72,14.86 0 top
PWRSTAT  2.03,35.94 0 top
Q1  31.24,12.19 0 top
R1  14.73,7.11 270 top
R2  12.7,7.1 270 top
R3  23.5,14.73 180 top
R4  3.81,35.81 90 top
R5  3.94,31.75 90 top
R6  56.64,40.01 0 top
SJ1  37.08,8.64 180 top
SJ2  58.42,44.83 270 bottom
SJ3  55.88,44.83 270 bottom
SJ4  53.34,44.83 270 bottom
SJ5  50.8,44.83 270 bottom
SJ6  40.64,38.99 90 top
SJ7  31.62,43.81 270 top
SW1  5.46,14.22 180 top
SW2  21.97,3.94 0 top
TP1  18.16,20.7 0 bottom
U2  23.5,12.06 270 top
U3  20.19,29.84 90 top
U$2  [SYMBOL_PLUS]  44.22,24.05 270 top
U$20  [SYMBOL_PLUS]  44.22,17.78 270 top
U$25  [ADAFRUIT_TEXT_30MM]  11.94,44.58 270 bottom
U$26  [FONA_LOGO]  29.46,36.07 270 bottom
U$33  [SYMBOL_MINUS]  44.22,22.23 270 top
U$34  [SYMBOL_MINUS]  43.96,29.64 270 top
U$35  [SYMBOL_PLUS]  38.12,12.06 270 top
U$36  [ADAFRUIT_5MM]  5.08,43.05 180 top
U$41  [SYMBOL_MINUS]  38.12,14.61 270 top
U$64  [PCBFEAT-REV-040]  6.22,41.4 0 top
X1  0.25,23.88 0 top
X3  34.8,42.29 180 top
X4  0.13,48.01 0 top
X6  53.72,21.72 90 top

### Tracks (layer width: path | path; a pad name or v marks a point on that pad's centre or on a via)
1.8V  (via drill 0.5)
  Top 0.254: D2.1 32.76,33.01 U3.P$29 32.51,32.77 31.37,32.77 30.48,31.88 v30.48,31.37 | X6.C1 57.4,9.1 v57.4,18.67
  Bottom 0.254: v57.4,18.67 57.4,28.19 55.63,29.97 35.56,29.97 34.42,31.11 30.73,31.11 v30.48,31.37
2.8V  (via drill 0.5)
  Top 0.254: U3.P$7 18.16,17.41 v18.16,19.3 18.16,23.24 18.54,23.62 22.73,23.62 24.51,21.84 28.7,21.84 32.26,18.29 37.85,18.29 39.24,16.89 46.1,16.89 v48.01,18.8 | v53.98,21.34 60.2,27.56 60.2,37.97 58.17,40.01 R6.2
  Bottom 0.254: v18.16,19.3 TP1.TP | v48.01,18.8 51.44,18.8 v53.98,21.34
5V  (via drill 0.5)
  Top 0.406: M1.5V JP6.4 38.48,6.48 SJ1.1
  Top 0.813: SW2.P1 v21.97,4.06 SW2.P2
  Bottom 0.61: v21.97,4.06 21.97,6.6 22.99,7.62 36.58,7.62 JP6.4
+3V3  (via drill 0.5)
  Top 0.406: M1.3V JP6.5 35.56,8.51 SJ1.3 v35.69,10.16 | L2.2 v26.54,44.58 C2.1 | v26.54,39.62 24,37.08 v19.43,37.08
  Bottom 0.406: v26.54,44.58 v26.54,39.62 | v19.43,37.08 16.13,33.78 16.13,16.89 19.81,13.21 27.81,13.21 29.72,11.3 31.24,11.3 32.38,12.45 32.38,15.88 33.91,17.4 37.97,17.4 38.48,16.89 38.48,12.06 36.96,10.54 36.07,10.54 v35.69,10.16
+5V
  Top 0.254: CHRG.A 18.83,6.06 18.92,5.97
  Top 0.406: C1.1 26.16,11.12 U2.4 24.07,11.12 22.35,9.4 22.35,8.64 21.72,8 21.08,8 19.82,6.74 SW2.O1
  Top 0.813: SW2.O2 19.47,1.99 18.92,2.54 18.92,5.97 18.92,6.19 SW2.O1
A0
  Top 0.406: JP7.6 M1.A0
A1
  Top 0.406: JP7.5 M1.A1
A2
  Top 0.406: JP7.4 M1.A2
A3
  Top 0.406: JP7.3 M1.A3
A4
  Top 0.406: JP7.2 M1.A4
A5
  Top 0.406: JP7.1 M1.A5
AREF
  Top 0.406: JP4.3 M1.AREF
BUZZ-
  Top 0.254: Q1.C 32.33,14.48 D3.A 36.07,14.48 JP3.1
D0
  Top 0.406: M1.D0 JP5.8
D1
  Top 0.406: JP5.7 M1.D1
D2
  Top 0.406: M1.D2 JP5.6
  Bottom 0.406: SJ2.1 JP5.6
D3
  Top 0.406: JP5.5 M1.D3
  Bottom 0.406: SJ3.1 JP5.5
D4
  Top 0.406: M1.D4 JP5.4
  Bottom 0.406: SJ4.1 JP5.4
D5
  Top 0.406: JP5.3 M1.D5
  Bottom 0.406: SJ5.1 JP5.3
D6
  Top 0.406: M1.D6 JP5.2
D7
  Top 0.406: JP5.1 M1.D7
D8
  Top 0.406: M1.D8 JP4.10
D9
  Top 0.406: M1.D9 JP4.9
D10
  Top 0.406: M1.D10 JP4.8
D11
  Top 0.406: M1.D11 JP4.7
D12
  Top 0.406: M1.D12 JP4.6
D13
  Top 0.406: JP4.5 M1.D13
DTR_5V
  Top 0.254: D9.C 37.21,32.13 36.83,32.51 36.83,35.94 37.21,36.32 37.21,41.4 DTR.1
GND  (via drill 0.5)
  Top 0.254: C14.5 34.57,22.64 33.78,21.84 U3.P$18 | D2.2 35.43,32.35 34.38,32.35 33.88,31.84 U3.P$28
  other vias: 7.24,2.67 16.76,12.95 2.41,28.07 2.29,19.43 9.65,36.58 12.19,44.07 33.4,20.07 41.4,22.99 39.12,24.51 38.99,19.18 56.9,36.96 35.94,24.89 32.89,39.62 36.83,45.09 31.75,40.77 30.48,40.89 28.83,40.51 33.27,45.72 24.89,35.43 28.07,30.48 36.83,43.81 36.32,39.62
  pour Bottom: -0.13,53.47 -0.13,-0.76 68.83,-0.89 68.83,53.34
  pour Top: -0.13,53.47 -0.13,-0.76 68.96,-0.89 68.96,53.34
GPS_PPS  (via drill 0.5)
  Top 0.254: v25.02,40.26 25.4,40.26 26.29,41.15 26.29,42.15 U3.P$37
  Bottom 0.254: PPS.1 18.92,44.83 23.62,40.13 24.89,40.13 v25.02,40.26
GSM_ANT
  Top 0.61: U3.P$66 6.25,23.84 6.22,23.88
  Top 1.016: 6.22,23.88 X1.P
HP+
  Top 0.406: X4.3-OUTER_SLEEVE 5.63,47.03 9.53,50.93 9.53,51.31 X4.2-TIP 10.57,51.41 13.46,48.51 C11.1
IOREF
  Top 0.406: M1.IOREF JP6.7
MIC1+
  Top 0.254: C15.2 C15.1 39.88,19.95 39.88,18.29 | C14.2 C14.1 36.79,19.09 36.83,19.05 | 36.83,19.05 37.85,19.05 38.61,18.29 39.88,18.29 | 39.88,18.29 42.42,18.29 JP2.1 | 30.97,22.84 30.86,22.73 30.86,20.83 32.64,19.05 36.83,19.05
  Top 0.406: X4.1-GND 2.93,42.41 3.81,41.53 8.64,41.53 27.32,22.84 30.97,22.84 U3.P$19
MIC1-
  Top 0.254: U3.P$20 33.69,23.84 34.04,23.5 35.93,23.5 C14.4 | C14.4 C15.5 C15.6 | C15.6 C15.7 | C15.6 C15.3 42.02,21.74 JP2.2 | C14.4 C14.3 C14.6 C14.7
N$1
  Top 0.254: CHRG.C 14.83,8.16 R1.1
N$2  (via drill 0.5)
  Top 0.254: R2.2 12.72,6.16 R1.2 14.73,5.59 15.75,4.57 v16.51,4.57 | U2.1 22.8,13.02 23.5,12.32 v23.5,12.06
  Bottom 0.254: v23.5,12.06 18.41,12.06 16.51,10.16 v16.51,4.57
N$3
  Top 0.61: U3.P$35 31.62,42.24 | 31.62,42.24 32.94,42.24 32.94,42.29 X3.3 | SJ7.2 31.62,42.24
N$4
  Top 0.254: PWRSTAT.A 3.81,34.89 R4.1
N$5
  Top 0.406: R3.1 24.8,14.38 U2.5
N$6
  Top 0.254: R2.1 11.09,8.05 DONE.A
N$9
  Top 0.254: R5.1 2.06,30.8 NETSTAT.A
N$10
  Top 0.813: SW2.S2 25.02,1.69 25.02,6.19 SW2.S1 24.47,9 D8.C
N$31
  Top 0.61: L2.1 30.1,44.83 SJ7.1
N$42  (via drill 0.5)
  Top 0.254: U3.P$9 20.19,20.57 v21.59,21.97 | v34.29,29.21 34.29,29.97 D9.A
  Bottom 0.254: v21.59,21.97 22.48,21.97 29.59,29.08 34.16,29.08 v34.29,29.21
NC
  Top 0.406: JP6.8 M1.RESERVED
NETSTAT  (via drill 0.5)
  Top 0.254: U3.P$50 13.19,40.4 21.08,32.51 25.53,32.51 v27.3,34.29 | IC1.12 39.64,32.62 v39.88,32.38
  Bottom 0.254: v39.88,32.38 39.37,32.89 34.67,32.89 31.62,35.94 28.96,35.94 v27.3,34.29
NETSTAT_5V  (via drill 0.5)
  Top 0.254: R5.2 5.39,32.7 6.1,33.4 6.1,38.61 6.35,38.86 8.64,38.86 9.14,38.35 10.03,38.35 v10.03,38.48 | IC1.11 39.88,33.27 45.72,39.12 JP10.6
  Bottom 0.254: v10.03,38.48 10.67,39.12 21.97,39.12 24,37.08 42.04,37.08 45.59,40.64 45.59,42.16 JP10.6
PWM1  (via drill 0.5)
  Top 0.254: Q1.B 30.29,11.49 29.72,12.06 PWM.1 | v21.21,38.23 21.19,38.24 U3.P$42
  Bottom 0.254: PWM.1 25.91,14.86 20.45,20.32 20.45,23.24 24.38,27.18 24.38,31.37 21.21,34.54 v21.21,38.23
PWRKEY  (via drill 0.5)
  Top 0.254: v19.3,22.73 19.3,17.56 U3.P$8 | D5.A 34.67,37.47 33.53,38.61 30.35,38.61 28.19,36.45 28.19,32.26 26.8,30.86 v22.86,30.86
  Bottom 0.254: v22.86,30.86 19.3,27.3 v19.3,22.73
PWRKEY_5V
  Top 0.254: JP10.8 SJ6.2 40.51,39.62 39.5,39.62 38.48,38.61 D5.C
PWRSTAT  (via drill 0.5)
  Top 0.254: U3.P$49 14.19,40.42 21.34,33.27 24.64,33.27 v27.18,35.81 | IC1.9 39.47,34.57 v39.62,34.42
  Bottom 0.254: v39.62,34.42 34.92,34.42 32.89,36.45 27.81,36.45 v27.18,35.81
PWRSTAT_5V  (via drill 0.5)
  Top 0.254: R4.2 3.81,38.1 5.46,39.75 9.27,39.75 v9.14,39.62 | IC1.8 40.43,35.22 43.18,37.97 JP10.7
  Bottom 0.254: v9.14,39.62 22.35,39.62 24.26,37.72 40.51,37.72 43.18,40.39 JP10.7
RESET
  Top 0.254: D6.A 61.47,38.99 61.47,26.42 49.66,14.61 38.35,14.61 36.83,16.13 31.24,16.13 28.45,18.92 27.56,18.92 27.05,18.41 27.05,17.59 U3.P$16
RESET_5V
  Top 0.254: D6.C 64.26,44.7 63.25,45.72 54.36,45.72 53.34,44.7 JP10.3
  Bottom 0.406: SJ4.2 JP10.3
RI
  Top 0.254: IC1.5 43.07,33.92 42.29,33.15 42.29,31.75 47.37,26.67 47.37,21.97 49.02,20.32 49.02,18.41 46.86,16.26 39.12,16.26 37.72,17.65 32.13,17.65 28.45,21.34 23.11,21.34 21.19,19.41 U3.P$10
RI_5V
  Top 0.254: IC1.6 47.15,34.57 48.26,35.69 JP10.5
RST  (via drill 0.5)
  Top 0.254: SW1.B 8.83,12.19 v5.46,12.19
  Top 0.305: SW1.B' SW1.B
  Top 0.406: M1.RESET JP6.6
  Bottom 0.254: v5.46,12.19 7.62,12.19 18.67,1.14 27.05,1.14
  Bottom 0.305: 27.05,1.14 32.89,1.14 33.02,1.27 M1.RESET
RTS
  Top 0.254: D7.A R6.1 55.75,39.94 55.75,38.48 56.13,38.1 58.42,38.1 59.69,36.83 59.69,28.32 46.99,15.62 38.86,15.62 37.34,17.14 31.75,17.14 28.32,20.57 24.77,20.57 24.13,19.94 24.13,19.05 24.19,18.99 U3.P$13
RTS_5V
  Top 0.254: JP10.4 50.8,40.13 D7.C
  Bottom 0.406: SJ5.2 JP10.4
RXD_5V
  Top 0.254: D4.C 60.45,44.32 JP10.1
  Bottom 0.406: SJ2.2 JP10.1
SCL
  Top 0.406: JP4.1 M1.SCL
SDA
  Top 0.406: M1.SDA JP4.2
SIMCLK  (via drill 0.5)
  Top 0.254: U3.P$31 33.45,34.84 34.29,35.69 35.31,35.69 | 35.31,35.69 36.07,35.69 36.07,34.92 D2.4 | v35.31,36.2 35.31,35.69 | v52.45,11.05 52.56,10.94 X6.C3
  Bottom 0.254: v35.31,36.2 46.99,36.2 51.69,31.5 57.4,31.5 60.2,28.7 60.2,15.49 55.75,11.05 v52.45,11.05
SIMDATA  (via drill 0.5)
  Top 0.254: D2.5 35.43,34.16 35.12,33.84 U3.P$30 30.54,33.84 v30.48,33.91 | X6.C7 51.97,34.57 v48.39,30.99
  Bottom 0.254: v48.39,30.99 48.13,30.73 35.56,30.73 34.67,31.62 33.27,31.62 30.99,33.91 v30.48,33.91
SIMRST  (via drill 0.5)
  Top 0.254: D2.3 36.18,31.89 v36.32,31.75 | v29.59,35.05 30.38,35.84 U3.P$32 | X6.C2 55.1,12.17 v55.24,12.32
  Bottom 0.254: v29.59,35.05 30.86,35.05 33.66,32.26 35.81,32.26 v36.32,31.75 36.58,31.5 46.1,31.5 46.48,31.88 49.4,31.88 50.55,30.73 56.9,30.73 58.8,28.83 58.8,15.88 v55.24,12.32
SPEAKER1+  (via drill 0.5)
  Top 0.254: C16.2 C16.1 40.01,25.71 40.01,23.88 39.62,23.5 37.34,23.5 36.83,24 | C17.2 C17.1 36.83,25.71 36.83,24 | U3.P$21 33.7,24.84 34.54,24 36.83,24
  Top 0.305: JP1.1 40.06,25.65 C16.1
  Top 0.406: U3.P$21 26.34,24.84 10.03,41.15 v10.03,41.66 | v9.27,45.34 9.46,45.15 C11.2
  Bottom 0.406: v10.03,41.66 9.27,42.42 v9.27,45.34
SPEAKER1-
  Top 0.254: 35.07,26.67 C17.7 C17.6 | C17.6 C17.5 | C17.6 C17.3 C16.6 | C16.6 C16.7 | C16.6 C16.3 C16.4 42.19,28.35 | U3.P$22 33.47,25.84 34.16,26.54 34.16,27.3 34.29,27.43 35.07,27.43 C17.6
  Top 0.305: 42.19,28.35 42.26,28.35 JP1.2
TXD_5V
  Top 0.254: IC1.3 48.88,32.62 50.93,34.67 50.93,35.31 51.94,36.32 51.94,40.39 52.45,40.89 54.23,40.89 55.63,42.29 JP10.2
  Bottom 0.406: SJ3.2 JP10.2
UART_RXD
  Top 0.254: D4.A 60.96,40.77 60.96,26.67 49.4,15.11 38.61,15.11 37.08,16.64 31.5,16.64 28.57,19.56 26.67,19.56 26.19,19.08 U3.P$15
UART_TXD  (via drill 0.5)
  Top 0.254: U3.P$14 25.15,17.49 v25.15,19.56 | IC1.2 45.62,31.97 47.5,30.1 v47.5,28.7
  Bottom 0.254: v25.15,19.56 25.15,22.23 30.61,27.69 35.56,27.69 37.34,29.46 46.74,29.46 v47.5,28.7
VBAT  (via drill 0.5)
  Top 0.254: D3.C 35.94,11.94 JP3.2
  Top 0.305: U2.3 21.15,11.12 v20.7,10.67
  Top 0.406: v20.7,10.67 20.5,10.47 D8.A
  Top 0.61: U3.P$4 15.19,16.26 16.19,16.26 17.19,16.26 U3.P$6
  Top 0.813: CN2.2 7.38,6.88 10.29,9.78 14.22,9.78 | 14.22,9.78 14.73,10.29 14.73,12.35 C6.1 14.71,14.56 C5.1 16.34,14.59 | C7.1 19.36,14.93 D1.C 16.49,14.65 16.19,14.65 16.19,14.73 | U3.P$5 16.19,16.26 16.19,14.73 | 14.22,9.78 19.99,9.78 D8.A | 16.72,14.59 16.34,14.59 | 16.34,14.59 16.19,14.73
  Bottom 0.406: JP3.2 32.77,8.76 27.43,8.76 25.53,10.67 v20.7,10.67
VCCIO  (via drill 0.5)
  Top 0.254: SJ1.2 38.35,8.64
  Top 0.305: SJ1.2 37.08,10.79 38.23,11.94 45.34,11.94 v46.35,12.95 | v45.72,26.67 45.72,26.8 42.8,29.72 39.5,29.72 38.23,30.99 IC1.14
  Bottom 0.305: v46.35,12.95 46.35,26.04 v45.72,26.67
VIN
  Top 0.406: JP6.1 M1.VIN
VRTC
  Top 0.254: C9.1 27.75,14.79 28.19,15.24 U3.P$17

### Text on the board
tPlace: PPS | bias | GPS | DTR | Key | Pwr | Net | RI | RTS | RST | TX | RX | 50Ω | Ant. | GND | adafruit! | PWR | FONA+GPS | Net | SPKR | GSM ANT | MIC | Reset | Buzzer | GSM Cell-Phone | with GPS | Data/Voice/SMS | PWM | 2G GSM / SIM Card | LiPoly | Vio | DONE/CHG | 3V | 5V | RUN | CHRG
bPlace: CTIA Headset / TRRS: LR-M | 2.8V